# EAGLE design can bus hat (EAGLE 9.6.2)
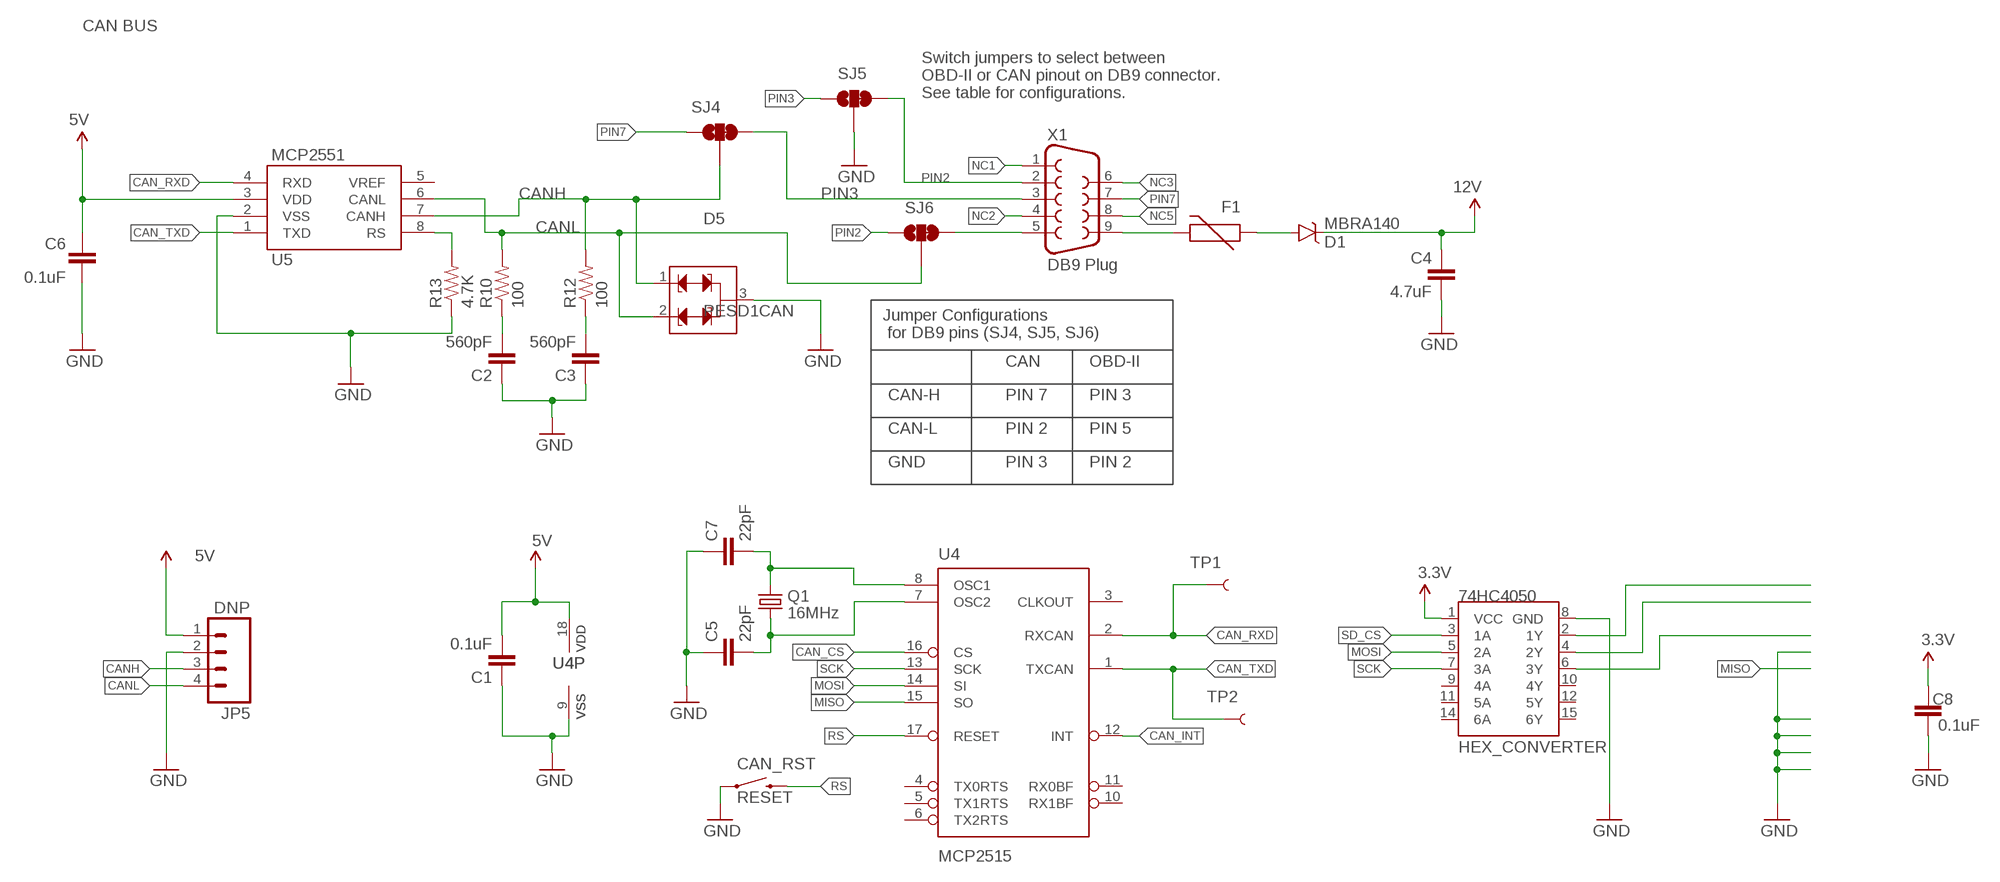
[diagram p0: schematic, sheet 1, part 1 of 2]
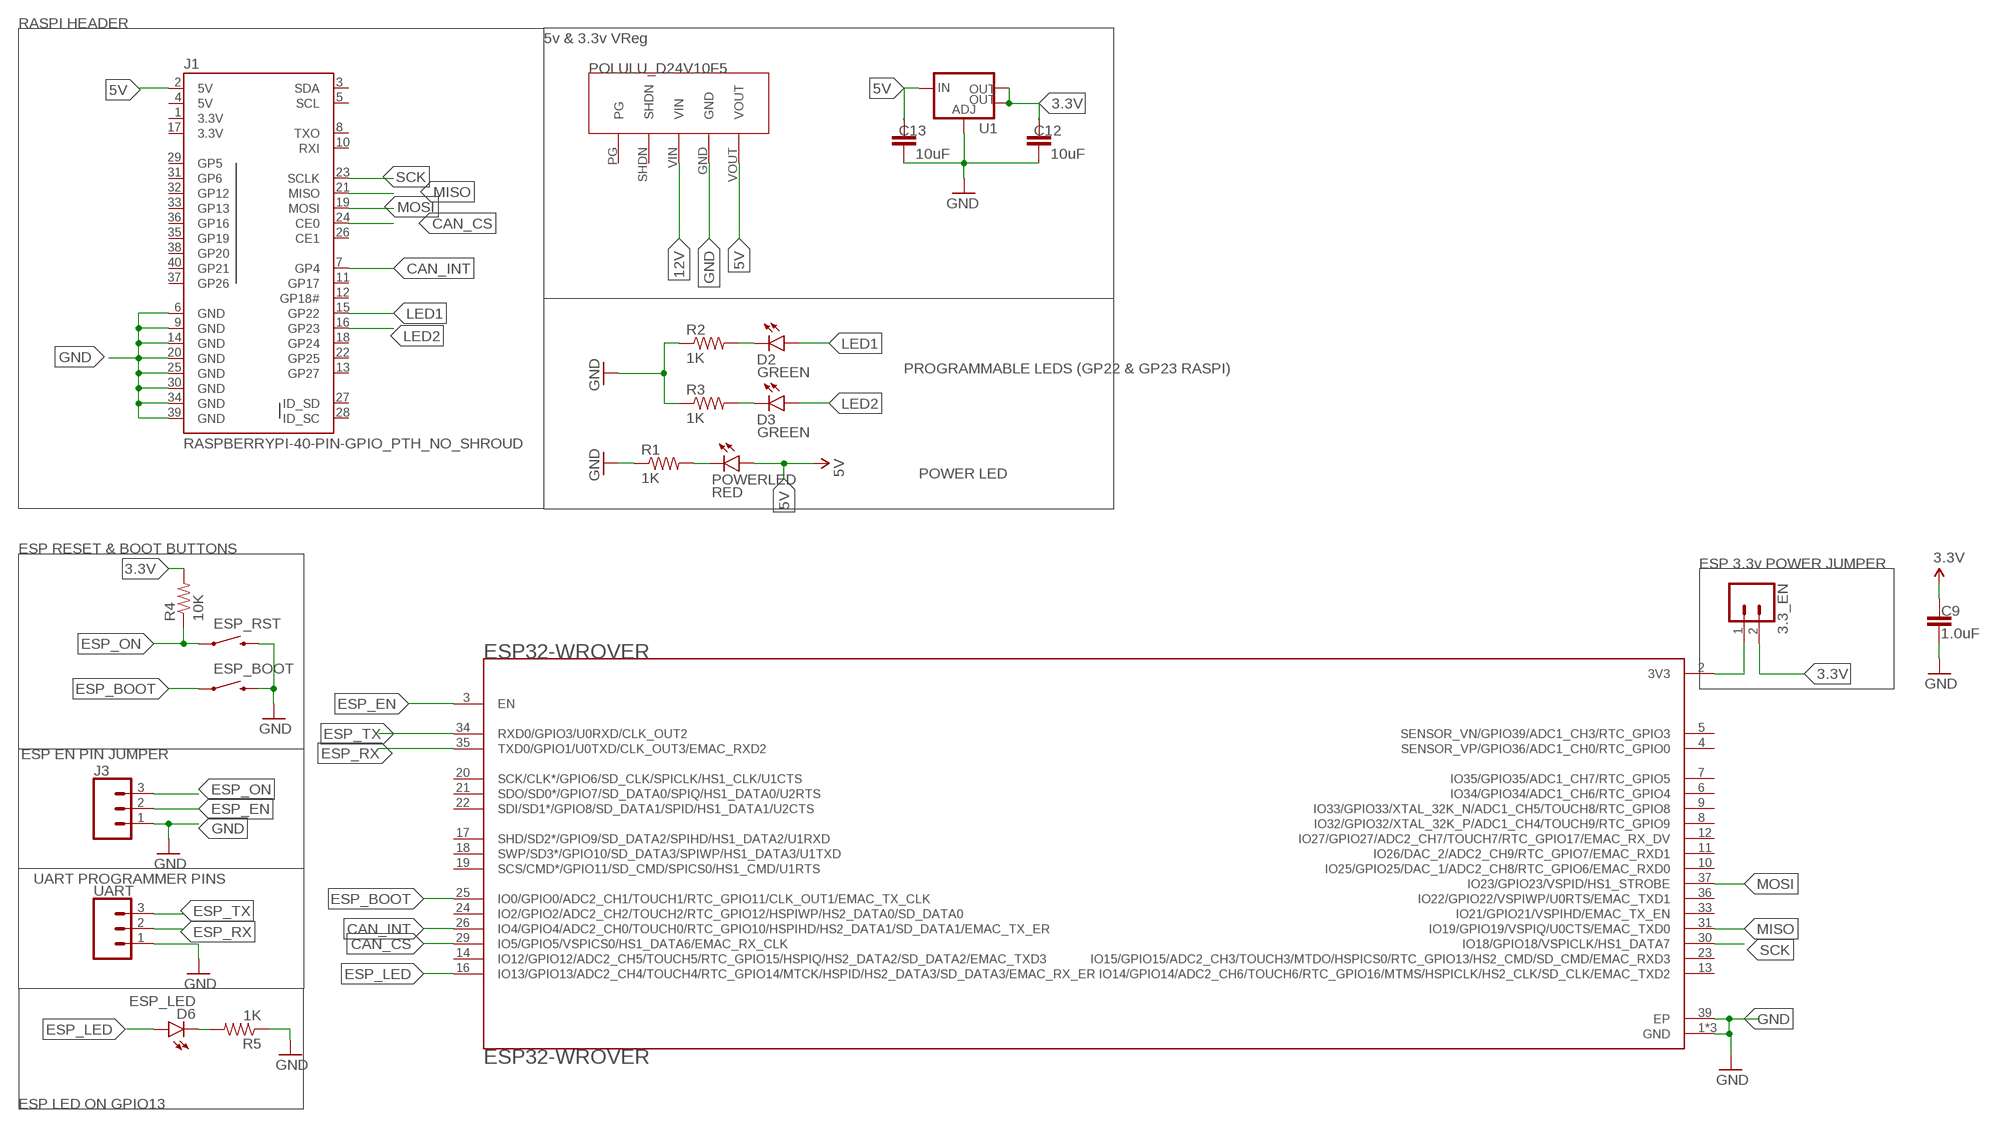
[diagram p1: schematic, sheet 1, part 2 of 2]

## Parts
3.3_EN  CONN_02  [1X02]
74HC4050  HEX_CONVERTER  [SO016]
C1  0.1uF  0.1UF-25V(+80/-20%)(0603)  [0603-CAP]
C2  560pF  560PF-50V-5%(0603)  [0603-CAP]
C3  560pF  560PF-50V-5%(0603)  [0603-CAP]
C4  4.7uF  4.7UF-6.3V-10%(0603)0603  [0603-CAP]
C5  22pF  22PF-50V-5%(0603)  [0603-CAP]
C6  0.1uF  0.1UF-25V(+80/-20%)(0603)  [0603-CAP]
C7  22pF  22PF-50V-5%(0603)  [0603-CAP]
C8  0.1uF  0.1UF-25V(+80/-20%)(0603)  [0603-CAP]
C9  1.0uF  1.0UF-16V-10%(0603)  [0603-CAP]
C12  10uF  0.1UF-25V(+80/-20%)(0603)  [0603-CAP]
C13  10uF  0.1UF-25V(+80/-20%)(0603)  [0603-CAP]
CAN_RST  RESET  SWITCH-MOMENTARY-2SMD  [TACTILE-SWITCH-SMD]
D1  MBRA140  [SMA-DIODE]
D2  GREEN  LED-GREEN0603  [LED-0603]
D3  GREEN  LED-GREEN0603  [LED-0603]
D5  PESD1CAN  [SOT23-3]
D6  ESP_LED  LED-RED0603  [LED-0603]
ESP32-WROVER  ESP32-WROVER  [XCVR_ESP32-WROVER]
ESP_BOOT  RESET  SWITCH-MOMENTARY-2SMD  [TACTILE-SWITCH-SMD]
ESP_RST  RESET  SWITCH-MOMENTARY-2SMD  [TACTILE-SWITCH-SMD]
F1  PTCTHERMISTOR1206  [PTC-1206]
J1  RASPBERRYPI-40-PIN-GPIO_PTH_NO_SHROUD  [2X20]
J3  CONN_03  [1X03]
JP5  DNP  M04PTH  [1X04]
POLULU_D24V10F5  POLOLU5V,1ASTEP-DOWNVOLTAGEREGULATORD24V10F5  [POLULU-VREG]
POWERLED  RED  LED-RED0603  [LED-0603]
Q1  16MHz  CRYSTAL5X3  [CRYSTAL-SMD-5X3]
R1  1K  1KOHM-1/10W-1%(0603)  [0603-RES]
R2  1K  1KOHM-1/10W-1%(0603)  [0603-RES]
R3  1K  1KOHM-1/10W-1%(0603)  [0603-RES]
R4  10K  1KOHM-1/10W-1%(0603)  [0603-RES]
R5  1K  1KOHM-1/10W-1%(0603)  [0603-RES]
R10  100  100OHM-1/10W-1%(0603)  [0603-RES]
R12  100  100OHM-1/10W-1%(0603)  [0603-RES]
R13  4.7K  4.7KOHM-1/10W-1%(0603)  [0603-RES]
SJ4  JUMPER-PAD-3-2OF3_NC_BY_TRACE_SMALL  [PAD-JUMPER-3-2OF3_NC_BY_TRACE_YES_SILK_FULL_BOX]
SJ5  JUMPER-PAD-3-2OF3_NC_BY_TRACE_SMALL  [PAD-JUMPER-3-2OF3_NC_BY_TRACE_YES_SILK_FULL_BOX]
SJ6  JUMPER-PAD-3-2OF3_NC_BY_TRACE_SMALL  [PAD-JUMPER-3-2OF3_NC_BY_TRACE_YES_SILK_FULL_BOX]
TP1  TEST-POINT3X5  [PAD.03X.05]
TP2  TEST-POINT3X5  [PAD.03X.05]
U1  VR_REGULATOR_LM1117SOT223  [SOT223]
U4  MCP2515  MCP2510SO  [SO-18W]
U5  MCP2551  [SO08]
UART  CONN_03  [1X03]
X1  DB9 Plug  DB9MALE  [DB9_MALE]

## Nets
3.3V: 3.3_EN.2 74HC4050.1(VCC) C8.2 C9.1 C12.2 R4.2 U1.2(OUT) U1.4(OUT)
5V: C1.2 C6.2 C13.2 J1.2(5V) JP5.1 POLULU_D24V10F5.VOUT POWERLED.A U1.3(IN) U4.18(VDD) U5.3(VDD)
12V: C4.1 D1.C POLULU_D24V10F5.VIN
CAN_CS: ESP32-WROVER.29(IO5/GPIO5/VSPICS0/HS1_DATA6/EMAC_RX_CLK) J1.24(CE0) U4.16(CS)
CAN_INT: ESP32-WROVER.26(IO4/GPIO4/ADC2_CH0/TOUCH0/RTC_GPIO10/HSPIHD/HS2_DATA1/SD_DATA1/EMAC_TX_ER) J1.7(GP4) U4.12(INT)
CAN_RXD: TP1.P$1 U4.2(RXCAN) U5.4(RXD)
CAN_TXD: TP2.P$1 U4.1(TXCAN) U5.1(TXD)
CANH: D5.1 JP5.3 R12.2 SJ4.2 U5.7(CANH)
CANL: D5.2 JP5.4 R10.2 SJ6.2 U5.6(CANL)
ESP_BOOT: ESP32-WROVER.25(IO0/GPIO0/ADC2_CH1/TOUCH1/RTC_GPIO11/CLK_OUT1/EMAC_TX_CLK) ESP_BOOT.1
ESP_EN: ESP32-WROVER.3(EN) J3.2
ESP_LED: D6.A ESP32-WROVER.16(IO13/GPIO13/ADC2_CH4/TOUCH4/RTC_GPIO14/MTCK/HSPID/HS2_DATA3/SD_DATA3/EMAC_RX_ER)
ESP_ON: ESP_RST.1 J3.3 R4.1
ESP_RX: ESP32-WROVER.35(TXD0/GPIO1/U0TXD/CLK_OUT3/EMAC_RXD2) UART.2
ESP_TX: ESP32-WROVER.34(RXD0/GPIO3/U0RXD/CLK_OUT2) UART.3
GND: 74HC4050.8(GND) C1.1 C2.1 C3.1 C4.2 C5.1 C6.1 C7.1 C8.1 C9.2 C12.1 C13.1 CAN_RST.1 D5.3 ESP32-WROVER.1(GND) ESP32-WROVER.15(GND) ESP32-WROVER.38(GND) ESP32-WROVER.39(EP) ESP_BOOT.3 ESP_RST.3 J1.6(GND) J1.9(GND) J1.14(GND) J1.20(GND) J1.25(GND) J1.30(GND) J1.34(GND) J1.39(GND) J3.1 JP5.2 POLULU_D24V10F5.GND R1.1 R2.1 R3.1 R5.1 R13.1 SJ5.2 U1.1(ADJ) U4.9(VSS) U5.2(VSS) UART.1
LED1: D2.A J1.15(GP22)
LED2: D3.A J1.16(GP23)
MISO: ESP32-WROVER.31(IO19/GPIO19/VSPIQ/U0CTS/EMAC_TXD0) J1.21(MISO) U4.15(SO)
MOSI: 74HC4050.5(2A) ESP32-WROVER.37(IO23/GPIO23/VSPID/HS1_STROBE) J1.19(MOSI) U4.14(SI)
N$2: SJ6.3 X1.5
N$4: POWERLED.C R1.2
N$5: D2.C R2.2
N$6: D3.C R3.2
N$7: 3.3_EN.1 ESP32-WROVER.2(3V3)
N$9: C2.2 R10.1
N$10: C3.2 R12.1
N$12: D6.C R5.2
N$13: F1.2 X1.9
N$14: R13.2 U5.8(RS)
N$15: 74HC4050.2(1Y)
N$16: D1.A F1.1
N$17: C7.2 Q1.3 U4.8(OSC1)
N$18: C5.2 Q1.1 U4.7(OSC2)
N$19: 74HC4050.4(2Y)
N$24: 74HC4050.6(3Y)
NC1: X1.1
NC2: X1.4
NC3: X1.6
NC5: X1.8
PIN2: SJ5.3 SJ6.1 X1.2
PIN3: SJ4.3 SJ5.1 X1.3
PIN7: SJ4.1 X1.7
RS: CAN_RST.3 U4.17(RESET)
SCK: 74HC4050.7(3A) ESP32-WROVER.30(IO18/GPIO18/VSPICLK/HS1_DATA7) J1.23(SCLK) U4.13(SCK)
SD_CS: 74HC4050.3(1A)
Unconnected: 74HC4050.9(4A) 74HC4050.10(4Y) 74HC4050.11(5A) 74HC4050.12(5Y) 74HC4050.14(6A) 74HC4050.15(6Y) ESP32-WROVER.4(SENSOR_VP/GPIO36/ADC1_CH0/RTC_GPIO0) ESP32-WROVER.5(SENSOR_VN/GPIO39/ADC1_CH3/RTC_GPIO3) ESP32-WROVER.6(IO34/GPIO34/ADC1_CH6/RTC_GPIO4) ESP32-WROVER.7(IO35/GPIO35/ADC1_CH7/RTC_GPIO5) ESP32-WROVER.8(IO32/GPIO32/XTAL_32K_P/ADC1_CH4/TOUCH9/RTC_GPIO9) ESP32-WROVER.9(IO33/GPIO33/XTAL_32K_N/ADC1_CH5/TOUCH8/RTC_GPIO8) ESP32-WROVER.10(IO25/GPIO25/DAC_1/ADC2_CH8/RTC_GPIO6/EMAC_RXD0) ESP32-WROVER.11(IO26/DAC_2/ADC2_CH9/RTC_GPIO7/EMAC_RXD1) ESP32-WROVER.12(IO27/GPIO27/ADC2_CH7/TOUCH7/RTC_GPIO17/EMAC_RX_DV) ESP32-WROVER.13(IO14/GPIO14/ADC2_CH6/TOUCH6/RTC_GPIO16/MTMS/HSPICLK/HS2_CLK/SD_CLK/EMAC_TXD2) ESP32-WROVER.14(IO12/GPIO12/ADC2_CH5/TOUCH5/RTC_GPIO15/HSPIQ/HS2_DATA2/SD_DATA2/EMAC_TXD3) ESP32-WROVER.17(SHD/SD2*/GPIO9/SD_DATA2/SPIHD/HS1_DATA2/U1RXD) ESP32-WROVER.18(SWP/SD3*/GPIO10/SD_DATA3/SPIWP/HS1_DATA3/U1TXD) ESP32-WROVER.19(SCS/CMD*/GPIO11/SD_CMD/SPICS0/HS1_CMD/U1RTS) ESP32-WROVER.20(SCK/CLK*/GPIO6/SD_CLK/SPICLK/HS1_CLK/U1CTS) ESP32-WROVER.21(SDO/SD0*/GPIO7/SD_DATA0/SPIQ/HS1_DATA0/U2RTS) ESP32-WROVER.22(SDI/SD1*/GPIO8/SD_DATA1/SPID/HS1_DATA1/U2CTS) ESP32-WROVER.23(IO15/GPIO15/ADC2_CH3/TOUCH3/MTDO/HSPICS0/RTC_GPIO13/HS2_CMD/SD_CMD/EMAC_RXD3) ESP32-WROVER.24(IO2/GPIO2/ADC2_CH2/TOUCH2/RTC_GPIO12/HSPIWP/HS2_DATA0/SD_DATA0) ESP32-WROVER.33(IO21/GPIO21/VSPIHD/EMAC_TX_EN) ESP32-WROVER.36(IO22/GPIO22/VSPIWP/U0RTS/EMAC_TXD1) J1.3(SDA) J1.5(SCL) J1.8(TXO) J1.10(RXI) J1.11(GP17) J1.12(GP18#) J1.13(GP27) J1.18(GP24) J1.22(GP25) J1.26(CE1) J1.27(ID_SD) J1.28(ID_SC) J1.29(GP5) J1.31(GP6) J1.32(GP12) J1.33(GP13) J1.35(GP19) J1.36(GP16) J1.37(GP26) J1.38(GP20) J1.40(GP21) POLULU_D24V10F5.PG POLULU_D24V10F5.SHDN U4.3(CLKOUT) U4.4(TX0RTS) U4.5(TX1RTS) U4.6(TX2RTS) U4.10(RX1BF) U4.11(RX0BF) U5.5(VREF)

## Notes on the sheet
- CAN BUS | RASPI HEADER
- 5v & 3.3v VReg
- Switch jumpers to select between 
  OBD-II or CAN pinout on DB9 connector. 
  See table for configurations.
- Jumper Configurations
   for DB9 pins (SJ4, SJ5, SJ6)
- CAN | OBD-II
- CAN-H | PIN 7 | PIN 3
- PROGRAMMABLE LEDS (GP22 & GP23 RASPI)
- CAN-L | PIN 2 | PIN 5
- GND | PIN 3 | PIN 2
- POWER LED
- ESP RESET & BOOT BUTTONS
- ESP 3.3v POWER JUMPER
- ESP EN PIN JUMPER
- UART PROGRAMMER PINS
- ESP LED ON GPIO13

## Power pins joined to a net without a drawn wire
3.3V: J1.1(3.3V) J1.17(3.3V)
5V: J1.4(5V)

## Library data of the parts
3.3_EN = SparkFun-Connectors:CONN_02: Multi connection point. Often used as Generic Header-pin footprint for 0.1 inch spaced/style header connections On any of the 0.1 inch spaced packages, you can populate with these: Break Away Headers - Straight <https://www.sparkfun.com/products/116> (PRT-00116) Break Away Male Headers - Right Angle <https://www.sparkfun.com/products/553> (PRT-00553) Female Headers <https://www.sparkfun.com/products/115> (PRT-00115) Break Away Headers - Machine Pin <https://www.sparkfun.com/products/117> (PRT-00117) Break Away Female Headers - Swiss Machine Pin <https://www.sparkfun.com/products/743> (PRT-00743) For SCREWTERMINALS and SPRING TERMINALS visit here: Screw Terimnals on SparkFun.com <https://www.sparkfun.com/search/results?term=Screw+Terminals> (5mm/3.5mm/2.54mm spacing) This device is also useful as a general connection point to wire up your design to another part of your project. Our various solder wires solder well into these plated through hole pads. Hook-Up Wire - Assortment (Stranded, 22 AWG) <https://www.sparkfun.com/products/11375> (PRT-11375) Hook-Up Wire - Assortment (Solid Core, 22 AWG) <https://www.sparkfun.com/products/11367> (PRT-11367) View the entire wire category on our website here <https://www.sparkfun.com/categories/141> Special notes: Molex polarized connector foot print use with: PRT-08233 with associated crimp pins and housings. 2.54_SCREWTERM for use with PRT-10571. 3.5mm Screw Terminal footprints for PRT-08084 5mm Screw Terminal footprints for use with PRT-08432
74HC4050 = SparkFun-DigitalIC:HEX_CONVERTER: 74HC4050 Hex Buffer Level Shifter SMD SO016; PROD_ID: IC-09604
C1 C6 C8 = SparkFun-Capacitors:0.1UF-25V(+80/-20%)(0603): CAP-00810 Ceramic Standard decoupling cap; PROD_ID: CAP-00810
C2 C3 = SparkFun-Capacitors:560PF-50V-5%(0603): CAP-08749; PROD_ID: CAP-08749
C4 = SparkFun-Capacitors:4.7UF-6.3V-10%(0603): CAP-08280; PROD_ID: CAP-08280
C5 C7 = SparkFun-Capacitors:22PF-50V-5%(0603): CAP-07876; PROD_ID: CAP-07876
C9 = SparkFun-Capacitors:1.0UF-16V-10%(0603): CAP-00868; PROD_ID: CAP-00868
C12 C13 = SparkFun-Capacitors:0.1UF-25V(+80/-20%)(0603): CAP-00810 Ceramic Standard decoupling cap; PROD_ID: CAP-00810; VALUE: 0.1uF
CAN_RST ESP_BOOT ESP_RST = SparkFun-Electromechanical:SWITCH-MOMENTARY-2: Various NO switches- pushbuttons, reed, etc; PROD_ID: SWCH-08247
D1 = SparkFun-DiscreteSemi:MBRA140: 40V, 1A Schottky rectifier SMA/DO-214AC package DIO-08053; PROD_ID: DIO-08053
D2 D3 = SparkFun-LED:LED-GREEN: Green SMD LED Used in manufacturing of various products at SparkFun Packages: 0603 - SMD 0603 package [Product Link] <http://www.futureelectronics.com/en/technologies/semiconductors/optoelectronics/leds/Pages/9894312-LTST-C190GKT.aspx?CrossPart=HSMG-C190&IM=0> LilyPad 1206 - SMD1206 LilyPad package [Product Link] <http://www.futureelectronics.com/en/Technologies/Product.aspx?ProductID=IN150NGHARVATEKCORPORATION2049943&IM=0> 1206 - SMD1206 package [Product Link] <http://www.futureelectronics.com/en/technologies/semiconductors/optoelectronics/leds/Pages/8315665-LTST-C150KGKT.aspx?IM=0> 1206 Bottom Mount -SMD 1206 Bottom Mount [Product Link] <http://www.digikey.com/product-detail/en/lite-on-inc/LTST-C230KGKT/160-1456-1-ND/386854> SparkFun Products: Pro Mini 328 -5V <https://www.sparkfun.com/products/821> RedBoard <https://www.sparkfun.com/products/12757> MP3 Trigger <https://www.sparkfun.com/products/13720> Makey Makey <https://www.sparkfun.com/products/11076>; PROD_ID: DIO-00821
D5 = SparkFun-DiscreteSemi:PESD1CAN: CAN bus ESD protection diode PESD1CAN is used to protect two CAN bus lines from ESD. Link to datasheet <http://www.nxp.com/documents/data_sheet/PESD1CAN-U.pdf> SparkFun Products: SparkFun CAN-BUS Shield <https://www.sparkfun.com/products/13262>; PROD_ID: DIO-12501
D6 = SparkFun-LED:LED-RED: Red SMD LED Used in manufacturing of most products at SparkFun Packages: 0603 - SMD 0603 package [Product Link] <http://docs.avagotech.com/docs/AV02-0551EN> 0603 SMART - SMD 0603 SMART package ( more efficient and expensive)[Product Link] <http://www.osram-os.com/Graphics/XPic2/00077099_0.pdf> 1206 - SMD1206 package [Product Link] <https://www.sparkfun.com/datasheets/DevTools/LilyPad/Q150OVS4.pdff> SparkFun Products: Pro Mini 328 -5V <https://www.sparkfun.com/products/821> RedBoard <https://www.sparkfun.com/products/12757> IOIO-OTG <https://www.sparkfun.com/products/13613>; PROD_ID: DIO-00819; VALUE: RED
ESP32-WROVER = ESP32-WROVER:ESP32-WROVER: Module: combo; GPIO, I2C x2, I2S x2, SDIO, SPI x3, UART x3; 19.5dBm Check prices <https://pricing.snapeda.com/parts/ESP32-WROVER/Espressif%20Systems/view-part?ref=eda>; AVAILABILITY: Warning; DESCRIPTION: Bluetooth, WiFi 802.11b/g/n, Bluetooth v4.2 +EDR, Class 1, 2 and 3 Transceiver Module 2.4GHz ~ 2.5GHz PCB Trace Surface Mount; MF: Espressif Systems; MP: ESP32-WROVER; PACKAGE: Module Espressif Systems; PRICE: None; PURCHASE-URL: https://pricing.snapeda.com/search/part/ESP32-WROVER/?ref=eda
F1 = SparkFun-PowerIC:PTC: Resettable Fuse PTC Resettable Fuse. Spark Fun Electronics SKU : COM-08357; PROD_ID: RES-08585
J1 = SparkFun-Connectors:RASPBERRYPI-40-PIN-GPIO: Raspberry Pi GPIO Header 2x20 pin connector, as found on B, B+, A+ models. Both shrouded PTH and SMT versions available. SparkFun Products: GPIO Shrouded Header <https://www.sparkfun.com/products/13054>- PTH SparkFun Pi Wedge (Preassembled) <https://www.sparkfun.com/products/13717>
J3 UART = SparkFun-Connectors:CONN_03: Multi connection point. Often used as Generic Header-pin footprint for 0.1 inch spaced/style header connections On any of the 0.1 inch spaced packages, you can populate with these: Break Away Headers - Straight <https://www.sparkfun.com/products/116> (PRT-00116) Break Away Male Headers - Right Angle <https://www.sparkfun.com/products/553> (PRT-00553) Female Headers <https://www.sparkfun.com/products/115> (PRT-00115) Break Away Headers - Machine Pin <https://www.sparkfun.com/products/117> (PRT-00117) Break Away Female Headers - Swiss Machine Pin <https://www.sparkfun.com/products/743> (PRT-00743) Stackable Header - 3 Pin (Female, 0.1") <https://www.sparkfun.com/products/13875> (PRT-13875) For SCREWTERMINALS and SPRING TERMINALS visit here: Screw Terimnals on SparkFun.com <https://www.sparkfun.com/search/results?term=Screw+Terminals> (5mm/3.5mm/2.54mm spacing) This device is also useful as a general connection point to wire up your design to another part of your project. Our various solder wires solder well into these plated through hole pads. Hook-Up Wire - Assortment (Stranded, 22 AWG) <https://www.sparkfun.com/products/11375> (PRT-11375) Hook-Up Wire - Assortment (Solid Core, 22 AWG) <https://www.sparkfun.com/products/11367> (PRT-11367) View the entire wire category on our website here <https://www.sparkfun.com/categories/141> Special notes: Molex polarized connector foot print use with SKU : PRT-08232 with associated crimp pins and housings.
JP5 = SparkFun-Connectors:M04: Header 4 Standard 4-pin 0.1" header. Use with straight break away headers (SKU : PRT-00116), right angle break away headers (PRT-00553), swiss pins (PRT-00743), machine pins (PRT-00117), and female headers (PRT-00115). Molex polarized connector foot print use with SKU : PRT-08231 with associated crimp pins and housings. 1MM SMD Version SKU: PRT-10208
POLULU_D24V10F5 = Pololu 5V, 1A Step-Down Voltage Regulator D24V10F5:POLOLU5V,1ASTEP-DOWNVOLTAGEREGULATORD24V10F5: https://www.pololu.com/product/2831 Features nput voltage: [output voltage + dropout voltage] to 36 V Fixed 3.3 V, 5 V, 6 V, 9 V, or 12 V output (depending on regulator version) with 4% accuracy Maximum output current: 1 A Typical efficiency of 80% to 93% 500 kHz switching frequency (when not in power-save mode) 2 ms soft-start reduces in-rush current on power-up 200 μA typical no-load quiescent current Over-current and short-circuit protection, over-temperature shutoff Small size: 0.7″ × 0.5″ × 0.14″ (18 mm × 13 mm × 3.5 mm)
POWERLED = SparkFun-LED:LED-RED: Red SMD LED Used in manufacturing of most products at SparkFun Packages: 0603 - SMD 0603 package [Product Link] <http://docs.avagotech.com/docs/AV02-0551EN> 0603 SMART - SMD 0603 SMART package ( more efficient and expensive)[Product Link] <http://www.osram-os.com/Graphics/XPic2/00077099_0.pdf> 1206 - SMD1206 package [Product Link] <https://www.sparkfun.com/datasheets/DevTools/LilyPad/Q150OVS4.pdff> SparkFun Products: Pro Mini 328 -5V <https://www.sparkfun.com/products/821> RedBoard <https://www.sparkfun.com/products/12757> IOIO-OTG <https://www.sparkfun.com/products/13613>; PROD_ID: DIO-00819
Q1 = SparkFun-FreqCtrl:CRYSTAL: Various standard crystals. Proven footprints.; PROD_ID: XTAL-08218
R1-R3 R5 = SparkFun-Resistors:1KOHM-1/10W-1%(0603): RES-07856; PROD_ID: RES-07856
R4 = SparkFun-Resistors:1KOHM-1/10W-1%(0603): RES-07856; PROD_ID: RES-07856; VALUE: 1K
R10 R12 = SparkFun-Resistors:100OHM-1/10W-1%(0603): RES-07863; PROD_ID: RES-07863
R13 = SparkFun-Resistors:4.7KOHM-1/10W-1%(0603): RES-07857; PROD_ID: RES-07857
SJ4-SJ6 = SparkFun-Passives:JUMPER-PAD-3-2OF3_NC_BY_TRACE
TP1 TP2 = SparkFun-Passives:TEST-POINT: Bare copper test points for troubleshooting or ICT
U1 = eagle_fab:VR_REGULATOR_LM1117: Voltage Regulator LM1117 Standard adjustable voltage regulator but in SMD form. Spark Fun Electronics SKU : COM-00595; PROD_ID: VREG-08170
U4 = SparkFun-DigitalIC:MCP2510: CAN controller with SPI interface to any MCU. Original design by Microchip.; PROD_ID: IC-09906
U5 = SparkFun-DigitalIC:MCP2551: CAN transceiver; PROD_ID: IC-09907
X1 = SparkFun-Connectors:DB9: DB9 Connector Standard DB9 (D-Sub 9) serial connector. Can be used for CAN bus as well as RS485 and RS232. Footprint production proven. Here is the female version connector we sell at SparkFun: 9 Pin Female Serial Connector - PCB Mount <https://www.sparkfun.com/products/429> (PRT-00429) This connector has been used on the following SparkFun products: SparkFun RS232 Shifter - SMD <https://www.sparkfun.com/products/449> (PRT-00449) SparkFun RS232 Shifter SMD (No DB9) <https://www.sparkfun.com/products/8780> (PRT-08780); PROD_ID: CONN-09904

## Board
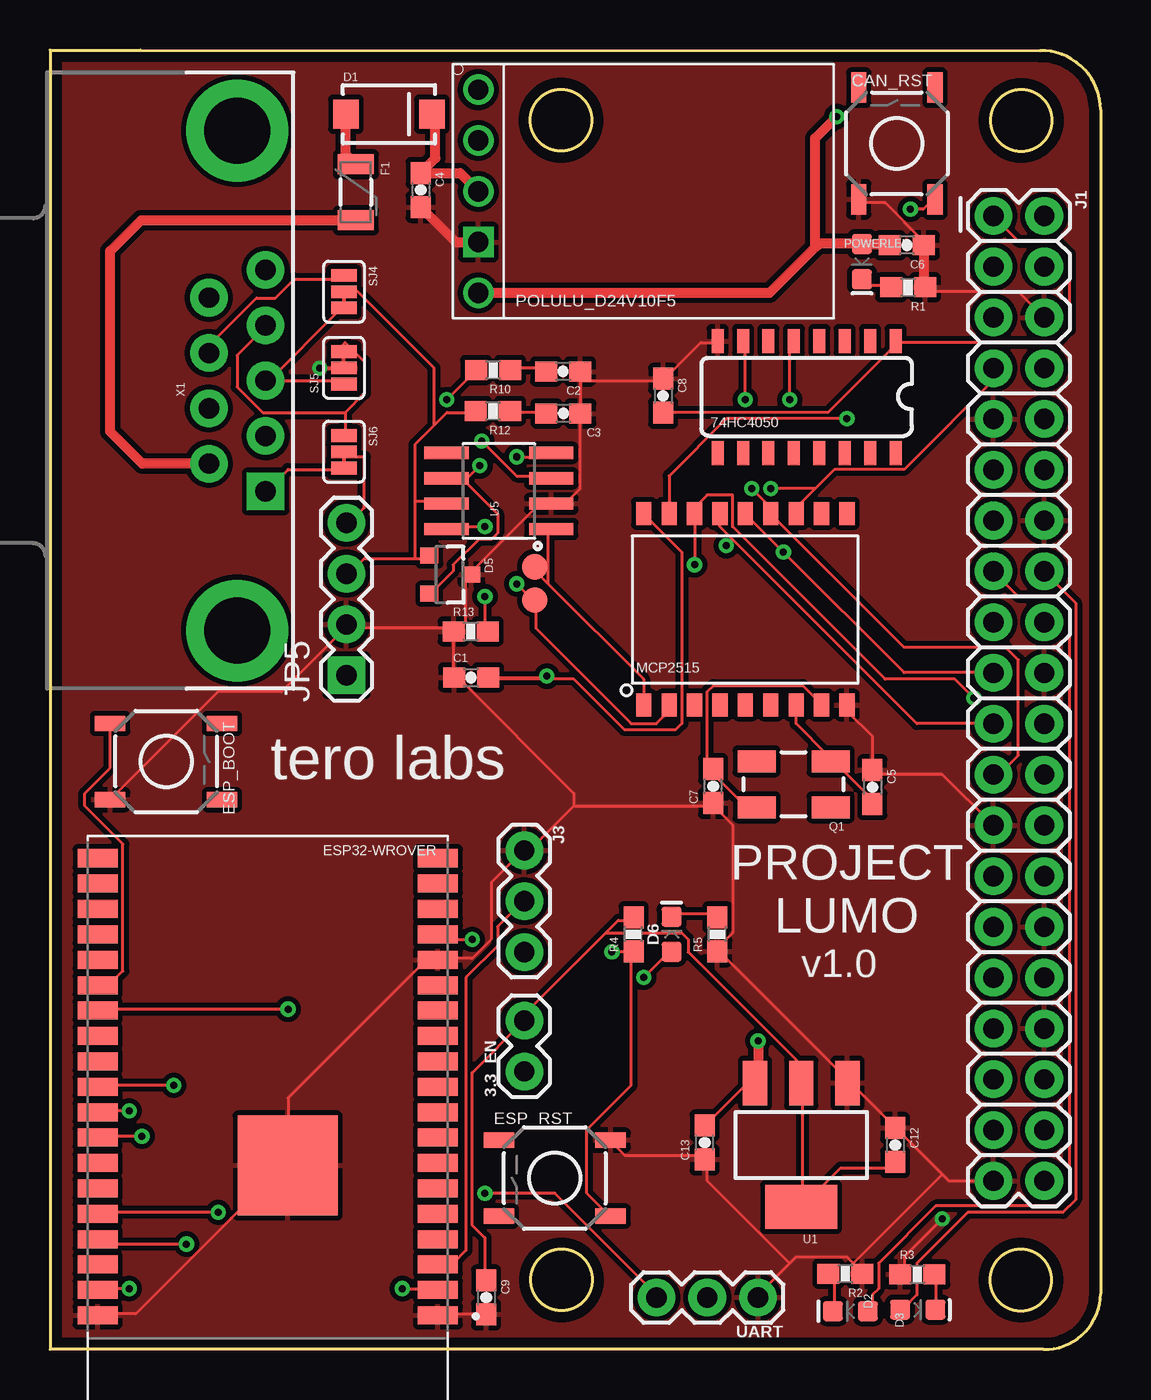
[diagram p2: board, top side]
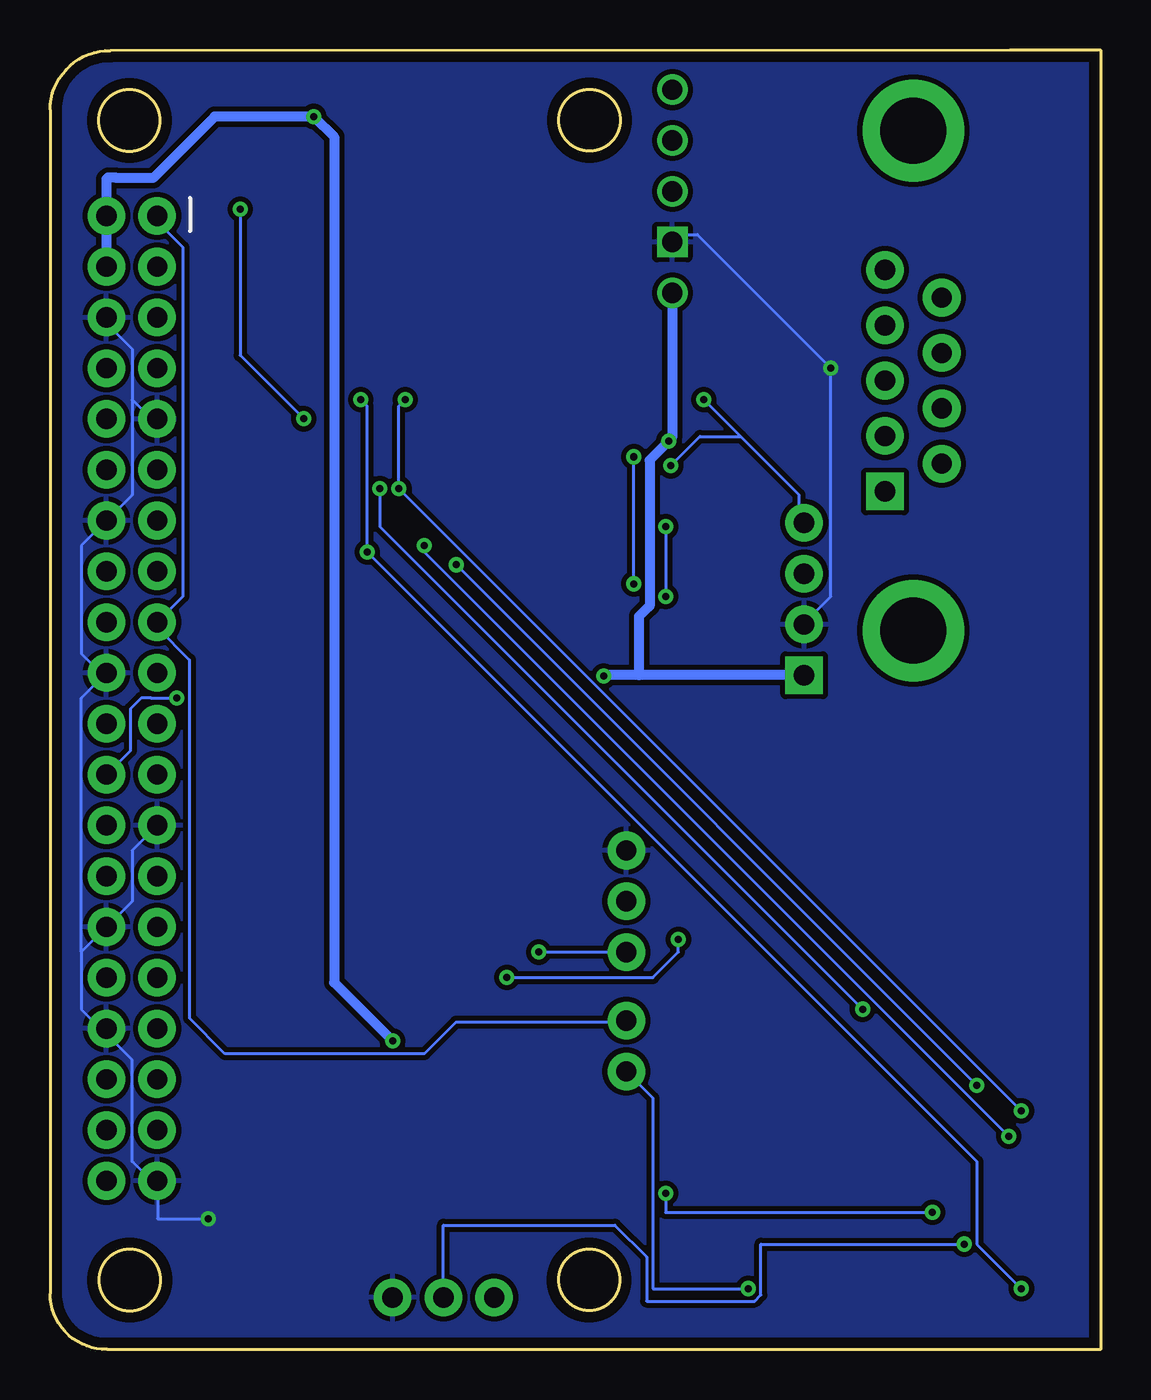
[diagram p3: board, bottom side, seen from below]

Size 52.52 x 64.99 mm. Coordinates in mm from the lower left corner, seen from the top.
Outline: 4.52,64.99 49.49,64.96 arc-90 52.52,62 52.52,2.78 arc-90 49.67,0 0,0 0,64.99 4.52,64.99
Outline: circle at 25.55,61.47 radius 1.53
Outline: circle at 48.55,61.46 radius 1.53
Outline: circle at 48.53,3.47 radius 1.53
Outline: circle at 25.57,3.48 radius 1.53
Copper layers (1*16): Top 0.035mm / dielectric 1.5mm / Bottom 0.035mm
Design rules "default *": minimum track width 6mil, minimum drill 0.35mm, track to track 6mil, track to pad 6mil, pad to pad 6mil, via to via 6mil, smd to smd 6mil, copper to edge 20mil, drill to drill 6mil, minimum pad ring 10mil, minimum via ring 8mil, stop-mask expansion 4mil, vias tented up to drill 0mil, thermal gap 10mil

### Footprints (pad centres in the part's own frame; a part is rotated, then mirrored left to right if it is on the bottom)
1X02 = drill 1.016 pad 1.88: 1 0,0; 2 2.54,0
SO016 = smd 0.6 x 1.2: 1 -4.445,-2.8; 2 -3.175,-2.8; 3 -1.905,-2.8; 4 -0.635,-2.8; 5 0.635,-2.8; 6 1.905,-2.8; 7 3.175,-2.8; 8 4.445,-2.8; 9 4.445,2.8; 10 3.175,2.8; 11 1.905,2.8; 12 0.635,2.8; 13 -0.635,2.8; 14 -1.905,2.8; 15 -3.175,2.8; 16 -4.445,2.8
0603-CAP = smd 1.1 x 1: 1 -0.85,0; 2 0.85,0
TACTILE-SWITCH-SMD = smd 1.524 x 0.762: 1 -2.794,1.905; 2 2.794,1.905; 3 -2.794,-1.905; 4 2.794,-1.905
SMA-DIODE = smd 1.27 x 1.47: A -2.15,0; C 2.15,0
LED-0603 = smd 1 x 1: A -0.877,0; C 0.877,0
SOT23-3 = smd 0.8 x 0.9: 1 -0.95,-1; 2 0.95,-1; 3 0,1.1
XCVR_ESP32-WROVER = smd 2 x 0.9: 1 -8.5,8.26; 2 -8.5,6.99; 3 -8.5,5.72; 4 -8.5,4.45; 5 -8.5,3.18; 6 -8.5,1.91; 7 -8.5,0.64; 8 -8.5,-0.63; 9 -8.5,-1.9; 10 -8.5,-3.17; 11 -8.5,-4.44; 12 -8.5,-5.71; 13 -8.5,-6.98; 14 -8.5,-8.25; 15 -8.5,-9.52; 16 -8.5,-10.79; 17 -8.5,-12.06; 18 -8.5,-13.33; 19 -8.5,-14.6; 20 8.5,-14.6; 21 8.5,-13.33; 22 8.5,-12.06; 23 8.5,-10.79; 24 8.5,-9.52; 25 8.5,-8.25; 26 8.5,-6.98; 27 8.5,-5.71; 28 8.5,-4.44; 29 8.5,-3.17; 30 8.5,-1.9; 31 8.5,-0.63; 32 8.5,0.64; 33 8.5,1.91; 34 8.5,3.18; 35 8.5,4.45; 36 8.5,5.72; 37 8.5,6.99; 38 8.5,8.26 | smd 5 x 5: 39 -1,0.76
PTC-1206 = smd 1 x 1.8: 1 -1.4,0; 2 1.4,0
2X20 = drill 1.016 pad 1.88: 1 0,0; 2 0,2.54; 3 2.54,0; 4 2.54,2.54; 5 5.08,0; 6 5.08,2.54; 7 7.62,0; 8 7.62,2.54; 9 10.16,0; 10 10.16,2.54; 11 12.7,0; 12 12.7,2.54; 13 15.24,0; 14 15.24,2.54; 15 17.78,0; 16 17.78,2.54; 17 20.32,0; 18 20.32,2.54; 19 22.86,0; 20 22.86,2.54; 21 25.4,0; 22 25.4,2.54; 23 27.94,0; 24 27.94,2.54; 25 30.48,0; 26 30.48,2.54; 27 33.02,0; 28 33.02,2.54; 29 35.56,0; 30 35.56,2.54; 31 38.1,0; 32 38.1,2.54; 33 40.64,0; 34 40.64,2.54; 35 43.18,0; 36 43.18,2.54; 37 45.72,0; 38 45.72,2.54; 39 48.26,0; 40 48.26,2.54
1X03 = drill 1.016 pad 1.88: 1 0,0; 2 2.54,0; 3 5.08,0
1X04 = drill 1.016 pad 1.88 square: 1 0,0 | drill 1.016 pad 1.88: 2 2.54,0; 3 5.08,0; 4 7.62,0
POLULU-VREG = drill 1.016 square: GND 7.62,0 | drill 1.016: PG 0,0; SHDN 2.54,0; VIN 5.08,0; VOUT 10.16,0
CRYSTAL-SMD-5X3 = smd 1.9 x 1.1: 1 -1.85,-1.15; 2 1.85,-1.15; 3 1.85,1.15; 4 -1.85,1.15
0603-RES = smd 1.1 x 1: 1 -0.85,0; 2 0.85,0
PAD-JUMPER-3-2OF3_NC_BY_TRACE_YES_SILK_FULL_BOX = smd 0.635 x 1.27: 1 -0.813,0; 2 0,0; 3 0.813,0
PAD.03X.05 = smd 1.27 x 1.27: P$1 0,0
SOT223 = smd 1.219 x 2.235: 1 -2.311,-3.099; 2 0,-3.099; 3 2.311,-3.099 | smd 3.6 x 2.2: 4 0,3.099
SO-18W = smd 0.762 x 1.143: 1 -5.08,-4.788; 2 -3.81,-4.788; 3 -2.54,-4.788; 4 -1.27,-4.788; 5 0,-4.788; 6 1.27,-4.788; 7 2.54,-4.788; 8 3.81,-4.788; 9 5.08,-4.788; 10 5.08,4.788; 11 3.81,4.788; 12 2.54,4.788; 13 1.27,4.788; 14 0,4.788; 15 -1.27,4.788; 16 -2.54,4.788; 17 -3.81,4.788; 18 -5.08,4.788
SO08 = smd 0.61 x 2.21: 1 -1.905,-2.616; 2 -0.635,-2.616; 3 0.635,-2.616; 4 1.905,-2.616; 5 1.905,2.616; 6 0.635,2.616; 7 -0.635,2.616; 8 -1.905,2.616
DB9_MALE = drill 1.016 pad 1.88: 1 5.54,-1.42; 2 2.77,-1.42; 3 0,-1.42; 4 -2.77,-1.42; 6 4.15,1.42; 7 1.38,1.42; 8 -1.38,1.42; 9 -4.15,1.42 | drill 1.016 pad 1.88 square: 5 -5.54,-1.42 | drill 3.302 pad 5.08: G1 -12.5,0; G2 12.5,0

### Placement (x,y rotation side)
3.3_EN  23.71,13.91 90 top
74HC4050  37.82,47.64 180 top
C1  21.05,33.61 0 top
C2  25.65,48.91 180 top
C3  25.67,46.81 180 top
C4  18.53,57.98 270 top
C5  41.11,28.13 270 top
C6  42.84,55.22 180 top
C7  33.15,28.17 90 top
C8  30.65,47.69 270 top
C9  21.81,2.6 270 top
C12  42.25,10.22 270 top
C13  32.73,10.35 90 top
CAN_RST  42.34,60.31 90 top
D1  16.94,61.77 0 top
D2  40.01,1.91 180 top
D3  43.38,1.99 0 top
D5  19.97,38.75 270 top
D6  31.08,20.76 90 top
ESP32-WROVER  10.88,9.97 180 top
ESP_BOOT  5.8,29.4 0 top
ESP_RST  25.23,8.57 180 top
F1  15.29,57.87 270 top
J1  47.16,56.69 270 top
J3  23.71,24.96 270 top
JP5  14.82,33.72 90 top
POLULU_D24V10F5  21.41,63 270 top
POWERLED  40.59,54.4 270 top
Q1  37.17,28.26 180 top
R1  42.89,53.12 180 top
R2  39.76,3.79 180 top
R3  43.36,3.76 0 top
R4  29.17,20.76 90 top
R5  33.36,20.76 90 top
R10  22.15,48.98 180 top
R12  22.14,46.93 180 top
R13  21.03,35.91 0 top
SJ4  14.69,52.9 270 top
SJ5  14.69,49.09 90 top
SJ6  14.69,44.89 270 top
TP1  24.23,37.49 0 top
TP2  24.22,39.14 180 top
U1  37.55,10.22 180 top
U4  34.76,37.02 0 top
U5  22.44,42.93 90 top
UART  35.39,2.6 180 top
X1  9.36,48.45 90 top

### Tracks (layer width: path | path; a pad name or v marks a point on that pad's centre or on a via)
3.3V
  Top 0.152: 37.62,7.18 39.52,9.08 42.06,9.08 C12.2 | 37.62,7.18 37.62,13.21 U1.2 37.3,13.53 37.3,14.48 31.9,19.88 31.9,20.51 31.58,20.83 27.77,20.83 | 37.62,7.18 U1.4 | C9.1 21.74,3.68 21.74,5.59 21.11,6.22 21.11,13.84 3.3_EN.2 23.71,16.76 27.77,20.83 | 27.77,20.83 27.93,20.99 28.41,21.46 29.04,21.46 R4.2 | 42.38,50.36 38.89,46.86 30.95,46.86 C8.2 | 42.38,50.36 50.32,50.36 50.95,50.99 50.95,54.8 50.32,55.44 48.41,55.44 47.46,56.39 J1.1 | 42.38,50.36 74HC4050.1
  Bottom 0.152: J1.1 47.14,56.39 45.87,55.12 45.87,37.66 47.14,36.39 J1.17 47.14,36.07 45.55,34.48 45.55,16.57 43.78,14.8 33.81,14.8 32.22,16.38 23.96,16.38 3.3_EN.2
5V  (via drill 0.35)
  Top 0.152: U4.18 29.68,41.78 31.58,39.88 31.58,31.31 31.27,30.99 28.73,30.99 26.19,33.53 22.06,33.53 C1.2 24.78,33.61 v24.84,33.67 | C13.2 32.85,11.3 35.08,13.53 U1.3 35.39,13.53 | 21.42,45.59 v21.58,45.43 23.33,43.69 24.92,43.69 U5.3
  Top 0.508: POLULU_D24V10F5.VOUT 35.97,52.84 38.25,55.12 | 38.25,55.12 38.44,55.31 40.56,55.31 POWERLED.A 41.93,55.28 C6.2 | 38.25,55.12 38.25,60.58 v39.33,61.66 | v35.39,15.43 35.39,13.47 U1.3
  Bottom 0.152: 21.42,52.58 POLULU_D24V10F5.VOUT | 39.2,61.47 v39.33,61.66
  Bottom 0.508: J1.4 J1.2 49.7,58.53 49.62,58.61 49.24,58.61 49.21,58.59 47.36,58.59 44.29,61.66 v39.33,61.66 38.32,60.64 38.32,18.35 v35.39,15.43 | JP5.1 23.08,33.72 | 23.08,33.72 24.79,33.72 v24.84,33.67 | POLULU_D24V10F5.VOUT 21.41,45.67 21.58,45.5 v21.58,45.43 22.54,44.47 22.54,37.17 22.57,37.15 22.6,37.15 23.08,36.67 23.08,33.72
12V
  Top 0.508: D1.C 19.27,61.6 19.27,59.57 C4.1 20.5,58.83 POLULU_D24V10F5.VIN
CAN_CS  (via drill 0.35)
  Top 0.152: v46.19,32.58 45.24,33.53 41.74,33.53 34.12,41.15 34.12,42.74 32.85,42.74 32.22,42.1 U4.16 v32.22,39.24 | v6.18,13.21 2.69,13.21 ESP32-WROVER.29
  Bottom 0.152: v46.19,32.58 47.46,32.58 47.97,32.58 48.51,32.04 48.51,29.94 49.68,28.77 J1.24 | v32.22,39.24 v6.18,13.21
CAN_INT  (via drill 0.35)
  Top 0.152: 38.25,43.05 39.2,44.01 42.7,44.01 47.46,48.77 J1.7 | 38.25,43.05 37.3,42.1 U4.12 | v11.9,17.02 2.69,17.02 ESP32-WROVER.26 | 38.25,43.05 v36.03,43.05
  Bottom 0.152: v11.9,17.02 36.03,41.15 v36.03,43.05
CAN_RXD  (via drill 0.35)
  Top 0.152: U4.2 30.95,31.94 30.31,31.31 29.04,31.31 24.28,36.07 24.28,37.34 TP1.P$1 23.96,37.66 v23.33,38.29 | v23.33,44.64 24.92,44.64 U5.4
  Bottom 0.152: v23.33,38.29 v23.33,44.64
CAN_TXD
  Top 0.152: U4.1 29.68,33.53 24.92,38.29 | 24.92,38.29 24.28,38.93 TP2.P$1 | 24.92,38.29 24.92,40.83 U5.1
CANH
  Top 0.152: 18.25,39.56 15.71,39.56 15.07,38.93 JP5.3 | 18.25,39.56 18.88,39.56 D5.1 | 19.2,46.23 18.25,45.28 18.25,42.42 | 19.2,46.23 19.84,46.86 21.11,46.86 R12.2 | 18.25,39.56 18.25,42.42 | SJ4.2 15.39,52.9 19.2,49.09 19.2,46.23 | 18.25,42.42 19.52,42.42 U5.7
CANL  (via drill 0.35)
  Top 0.152: 20.79,43.37 22.38,41.78 22.38,40.83 22.06,40.51 21.42,40.51 20.15,39.24 20.15,38.93 19.2,37.97 D5.2 | 20.79,43.37 19.84,43.37 U5.6 | v19.84,47.5 21.11,48.77 R10.2 | SJ6.2 14.76,44.64 15.71,44.64 15.71,42.1 15.07,41.47 JP5.4 | 20.79,43.37 U5.6 | U5.6 20.86,43.57 v21.49,44.2
  Bottom 0.152: 18,45.66 15.07,42.74 15.07,41.47 JP5.4 | 18,45.66 v19.84,47.5 | v21.49,44.2 20.03,45.66 18,45.66
ESP_BOOT
  Top 0.152: ESP_BOOT.1 3.01,29.08 1.74,27.81 1.74,27.18 3.64,25.27 3.64,18.92 2.69,17.97 ESP32-WROVER.25
ESP_EN
  Top 0.152: ESP32-WROVER.3 19.52,4.32 20.15,4.32 20.79,4.95 20.79,18.61 22.38,20.19 22.38,21.15 23.65,22.42 J3.2
ESP_LED  (via drill 0.35)
  Top 0.152: v29.68,18.61 30.95,19.88 D6.A | v21.11,20.51 19.52,20.51 ESP32-WROVER.16
  Bottom 0.152: v29.68,18.61 22.38,18.61 21.11,19.88 v21.11,20.51
ESP_ON  (via drill 0.35)
  Top 0.152: 29.04,19.88 29.04,13.21 26.82,10.99 26.82,7.81 27.77,6.86 ESP_RST.1 | 29.04,19.88 v28.09,19.88 | 29.04,19.88 R4.1
  Bottom 0.152: v28.09,19.88 J3.3
ESP_RX  (via drill 0.35)
  Top 0.152: v6.82,5.27 2.69,5.27 ESP32-WROVER.35
  Bottom 0.152: v6.82,5.27 16.98,5.27 16.98,2.73 17.3,2.41 22.69,2.41 22.69,4.64 24.28,6.22 32.85,6.22 UART.2
ESP_TX  (via drill 0.35)
  Top 0.152: v8.41,6.86 2.69,6.86 ESP32-WROVER.34 | v21.74,7.81 25.23,7.81 30.31,2.73 UART.3
  Bottom 0.152: v8.41,6.86 21.74,6.86 v21.74,7.81
GND  (via drill 0.35)
  Top 0.152: CAN_RST.1 40.47,57.34 41.74,57.34 43.65,55.44 C6.1 | R1.1 43.97,52.9 48.41,52.9 49.68,51.63 J1.6 | U4.9 39.84,31.94 41.11,30.67 C5.1 41.11,28.77 44.6,28.77 47.14,26.23 J1.25 | ESP_RST.3 28.09,10.35 28.73,9.72 32.54,9.72 C13.1 32.85,9.4 32.85,8.45 36.98,4.32 | 40.16,4.32 39.84,4.64 37.3,4.64 36.98,4.32 | 40.16,4.32 40.47,4 R2.1 | 36.98,4.32 35.39,2.73 UART.1 | v44.6,6.54 42.7,4.64 42.7,4 R3.1 | 44.6,8.76 42.38,10.99 C12.1 42.06,11.3 40.16,13.21 U1.1 39.84,13.53 33.49,19.88 R5.1 33.49,20.19 34.12,20.83 34.12,26.23 33.17,27.18 C7.1 32.85,27.18 26.19,27.18 | 44.6,8.76 44.92,8.45 47.14,8.45 J1.39 | 44.6,8.76 40.16,4.32 | v13.49,49.09 SJ5.2 | ESP_BOOT.3 8.41,32.89 11.58,32.89 14.76,36.07 JP5.2 15.07,36.07 20.15,36.07 R13.1 | C9.2 21.74,1.78 19.52,1.78 ESP32-WROVER.1 19.2,1.78 | ESP32-WROVER.38 2.69,1.78 4.28,1.78 11.58,9.08 ESP32-WROVER.39 11.9,9.4 11.9,12.57 18.57,19.24 19.2,19.24 ESP32-WROVER.15 19.52,19.56 21.11,19.56 22.06,20.51 22.06,23.37 23.65,24.96 J3.1 23.96,24.96 26.19,27.18 | 26.5,48.45 26.5,48.77 C2.1 26.5,48.45 | 26.5,48.45 26.5,46.86 C3.1 26.5,46.55 26.5,43.05 25.87,42.42 25.23,42.42 U5.2 24.92,42.1 24.28,42.1 21.11,38.93 D5.3 20.79,38.61 20.79,36.39 20.47,36.07 R13.1 | 26.5,48.45 30.63,48.45 C8.1 30.95,48.77 32.54,50.36 33.17,50.36 74HC4050.8 | R13.1 20.15,35.75 20.15,33.85 C1.1 20.47,33.53 26.19,27.81 26.19,27.18
  Top 0.508: C4.2 20.28,55.38 POLULU_D24V10F5.GND | C6.1 43.69,53.17 R1.1
  Bottom 0.152: 48.41,47.5 47.46,46.55 J1.9 | 48.41,47.5 48.41,50.04 49.68,51.31 J1.6 | 48.41,47.5 48.41,42.74 49.68,41.47 J1.14 50,41.15 50.95,40.2 50.95,34.8 50,33.85 J1.20 50,33.53 50.95,32.58 50.95,19.88 | 50.95,19.88 50.95,17.02 50,16.07 J1.34 49.68,15.75 48.41,14.48 48.41,9.4 47.46,8.45 J1.39 47.14,8.13 47.14,6.54 v44.6,6.54 | 50.95,19.88 50,20.83 J1.30 49.68,21.15 48.41,22.42 48.41,24.96 47.46,25.91 J1.25 | POLULU_D24V10F5.GND 21.11,55.44 21.11,55.75 20.15,55.75 v13.49,49.09 13.49,37.66 14.76,36.39 JP5.2
  pour Top (isolate 0.254): 52.54,64.96 52.54,0.19 0.09,0.19 0.09,64.96
  pour Bottom (isolate 0.254): 52.54,64.96 52.54,0.19 52.41,0.06 0.09,0.06 0.09,64.96
LED1
  Top 0.152: D2.A 41.11,2.1 41.11,2.73 41.43,3.05 41.43,4.32 44.28,7.18 50.32,7.18 50.95,7.81 50.95,37.02 50.32,37.66 48.41,37.66 47.46,38.61 J1.15
LED2
  Top 0.152: D3.A 42.7,2.1 43.33,2.73 43.33,4.32 45.87,6.86 50.63,6.86 51.27,7.49 51.27,37.34 50,38.61 J1.16
MISO  (via drill 0.35)
  Top 0.152: U4.15 33.49,41.15 34.12,40.51 | 34.12,40.51 43.33,31.31 47.14,31.31 J1.21 | v4.6,10.67 2.69,10.67 ESP32-WROVER.31 | 34.12,40.51 v33.81,40.2
  Bottom 0.152: v4.6,10.67 33.81,39.88 v33.81,40.2
MOSI  (via drill 0.35)
  Top 0.152: U4.14 34.76,41.78 v36.66,39.88 42.7,33.85 47.14,33.85 J1.19 | v36.98,47.5 36.98,50.36 74HC4050.5 | v3.96,3.05 2.69,3.05 ESP32-WROVER.37
  Bottom 0.152: v36.98,47.5 36.66,47.18 v36.66,39.88 6.18,9.4 6.18,5.27 v3.96,3.05
N$2
  Top 0.152: SJ6.3 14.44,44.01 11.9,44.01 10.95,43.05 X1.5
N$4
  Top 0.152: POWERLED.C 40.79,53.21 41.74,53.21 R1.2
N$5
  Top 0.152: D2.C 39.2,2.1 39.2,3.68 R2.2
N$6
  Top 0.152: D3.C 44.28,2.1 44.28,3.68 R3.2
N$7  (via drill 0.35)
  Top 0.152: v17.61,3.05 19.2,3.05 ESP32-WROVER.2
  Bottom 0.152: v17.61,3.05 22.38,3.05 22.38,12.57 3.3_EN.1
N$9
  Top 0.152: R10.1 23.01,49.09 24.6,49.09 C2.2
N$10
  Top 0.152: R12.1 23.01,46.86 24.6,46.86 C3.2
N$12
  Top 0.152: D6.C 31.27,21.78 33.17,21.78 R5.2
N$13
  Top 0.508: X1.9 4.62,44.3 3.01,45.91 3.01,54.93 4.55,56.47 F1.2
N$14  (via drill 0.35)
  Top 0.152: v21.74,37.66 21.74,36.07 R13.2 | v21.74,41.15 19.84,41.15 U5.8
  Bottom 0.152: v21.74,41.15 v21.74,37.66
N$16
  Top 0.508: F1.1 14.79,59.77 D1.A
N$17
  Top 0.152: Q1.3 35.08,26.86 33.17,28.77 C7.2 32.85,29.08 32.85,32.89 33.17,33.21 37.62,33.21 38.57,32.26 U4.8
N$18
  Top 0.152: C5.2 41.11,27.5 39.2,29.4 Q1.1 38.89,29.72 37.3,31.31 U4.7
PIN2
  Top 0.152: 14.76,46.86 14.76,45.91 SJ6.1 | 14.76,46.86 15.71,47.82 15.71,49.4 14.76,50.36 14.44,50.04 SJ5.3 | 14.76,46.86 10.63,46.86 9.36,48.13 9.36,49.72 10.63,50.99 X1.2
PIN3
  Top 0.152: 10.95,48.45 14.44,48.45 SJ5.1 | 10.95,48.45 14.44,51.94 SJ4.3 | 10.95,48.45 X1.3
PIN7
  Top 0.152: SJ4.1 14.44,53.53 12.22,53.53 11.26,52.58 10.31,52.58 7.77,50.04 X1.7
RS  (via drill 0.35)
  Top 0.152: U4.17 30.95,43.69 33.81,46.55 v39.84,46.55 | v43.01,57.02 43.65,57.02 43.97,57.34 CAN_RST.3
  Bottom 0.152: v39.84,46.55 43.01,49.72 v43.01,57.02
SCK  (via drill 0.35)
  Top 0.152: J1.23 47.46,28.77 48.41,29.72 48.41,34.48 47.78,35.12 42.7,35.12 36.03,41.78 U4.13 36.03,42.1 v35.08,43.05 | v34.76,47.5 34.76,50.36 74HC4050.7 | v3.96,11.94 2.69,11.94 ESP32-WROVER.30
  Bottom 0.152: v34.76,47.5 35.08,47.18 v35.08,43.05 v3.96,11.94

### Text on the board
tPlace: MCP2515 | tero labs | PROJECT / LUMO | v1.0